# EAGLE design interro-cpu-board-r3 (EAGLE 5.12)
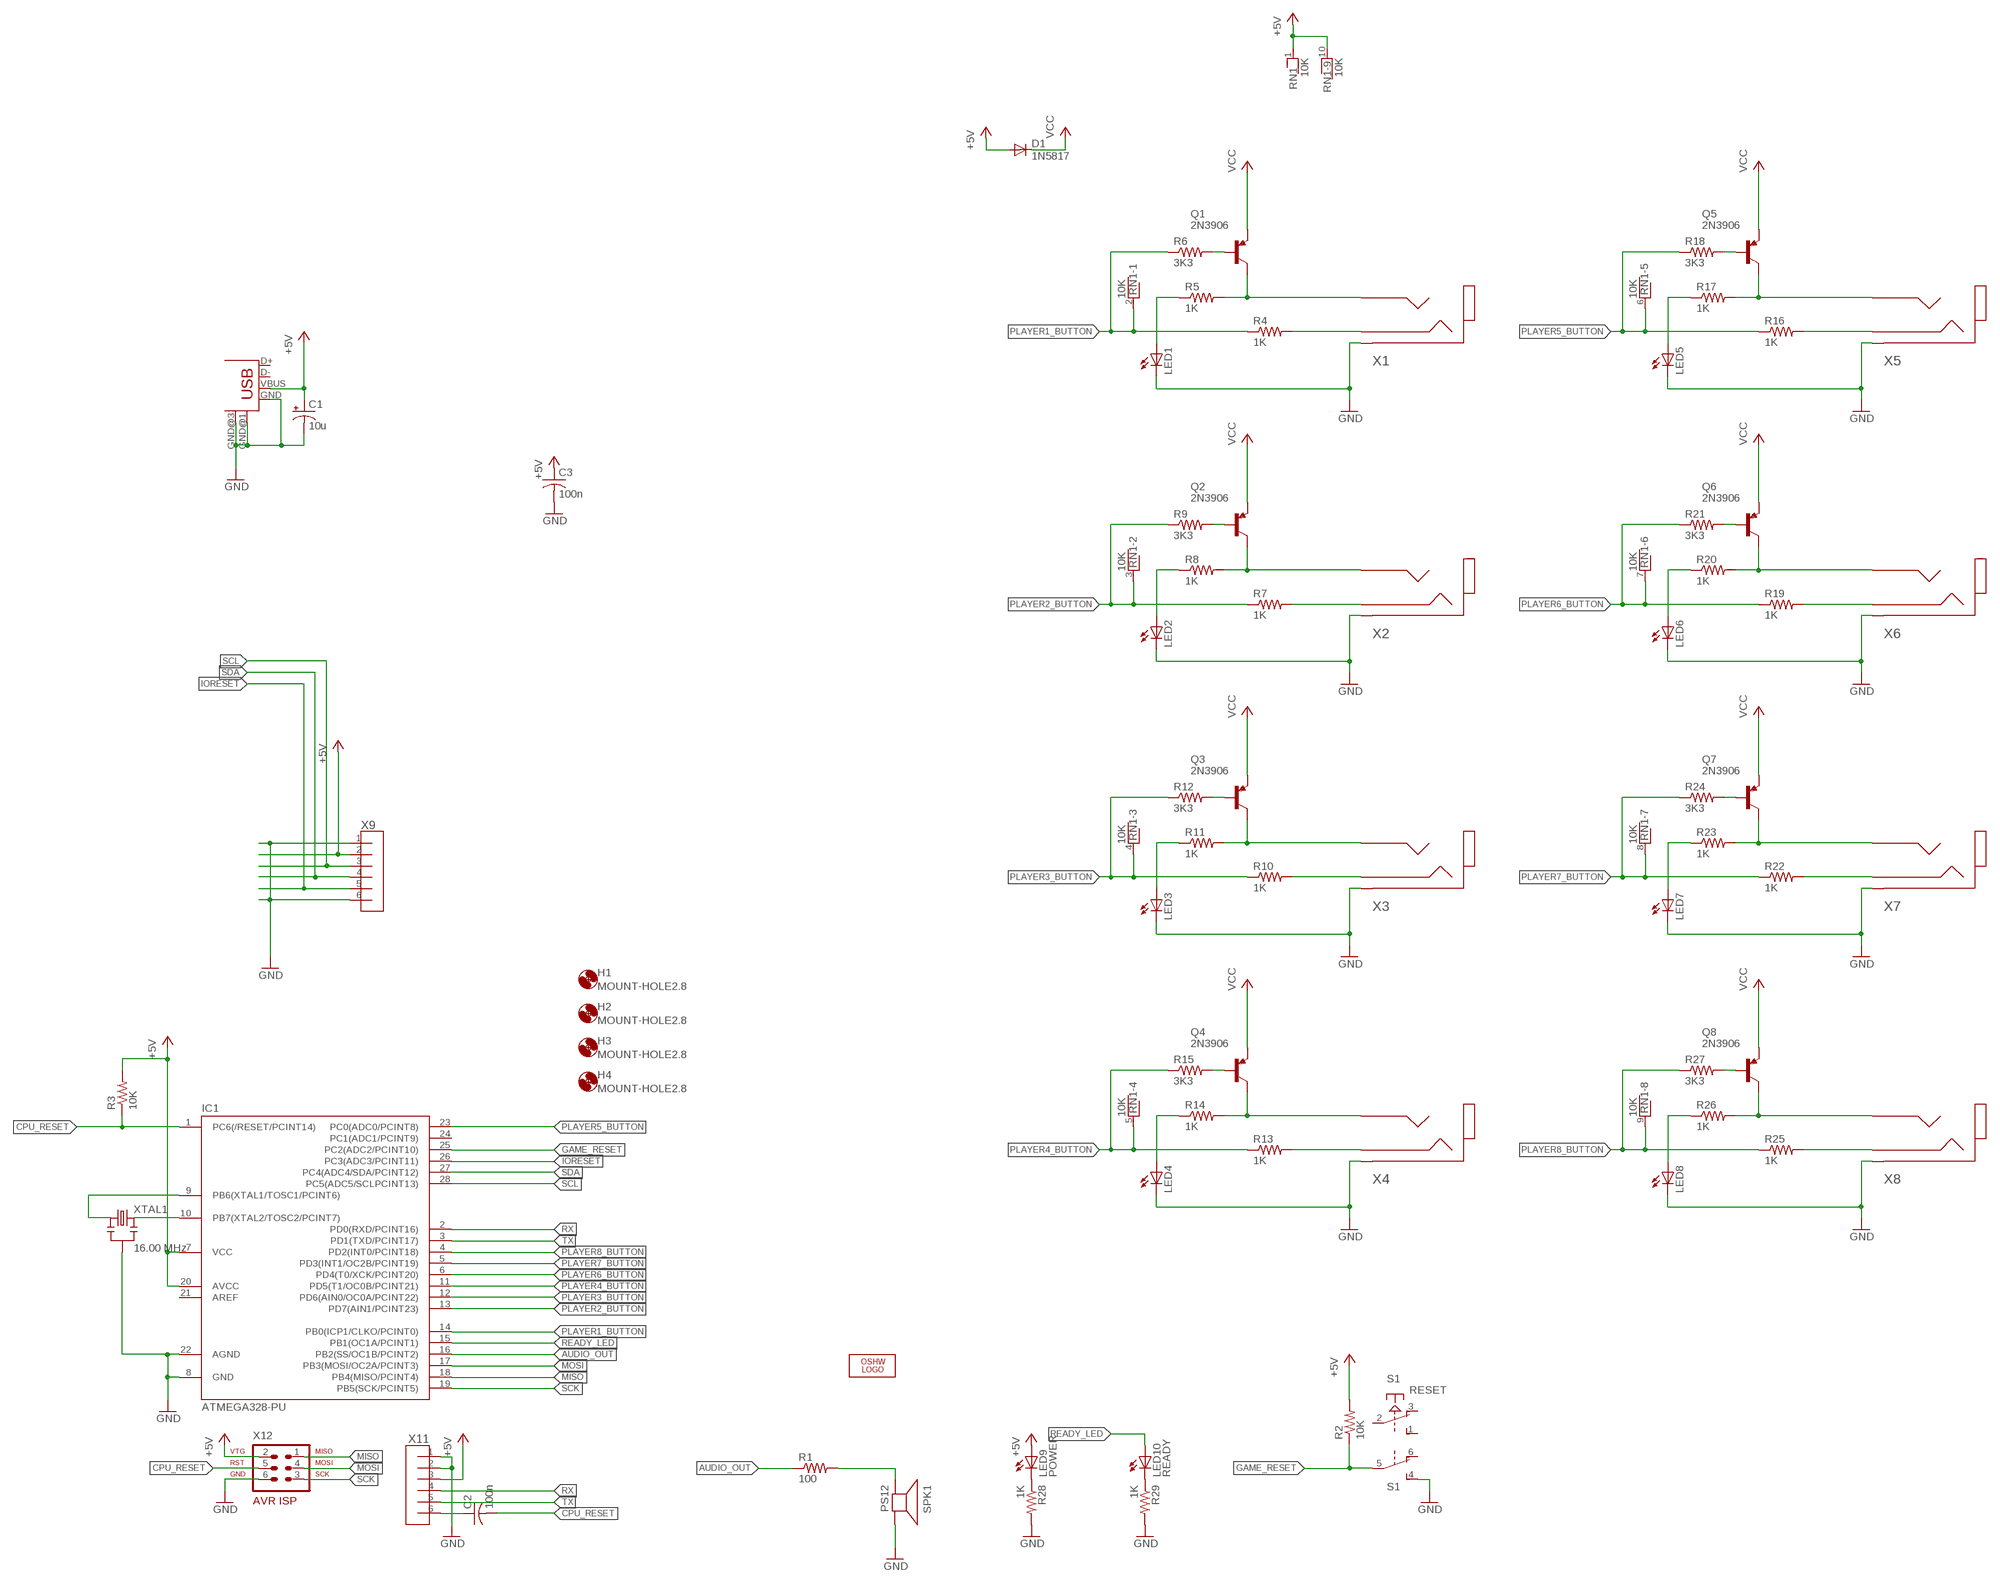
[diagram p0: schematic, sheet 1]

## Parts
C1  10u  CPOL-USE2-5  [E2-5]
C2  100n  C-US025-025X050  [C025-025X050]
C3  100n  C-US025-025X050  [C025-025X050]
D1  1N5817  1N4004  [DO41-10]
H1  MOUNT-HOLE2.8  [2,8]
H2  MOUNT-HOLE2.8  [2,8]
H3  MOUNT-HOLE2.8  [2,8]
H4  MOUNT-HOLE2.8  [2,8]
IC1  ATMEGA328-PU  MEGA48/88/168-PU  [DIL28-3]
LED1  LED3MM  [LED3MM]
LED2  LED3MM  [LED3MM]
LED3  LED3MM  [LED3MM]
LED4  LED3MM  [LED3MM]
LED5  LED3MM  [LED3MM]
LED6  LED3MM  [LED3MM]
LED7  LED3MM  [LED3MM]
LED8  LED3MM  [LED3MM]
LED9  POWER  LED3MM  [LED3MM]
LED10  READY  LED3MM  [LED3MM]
LOGO1  OSHW_LOGO_FILLX0150-NT  [OSHW_FILLX150_NOTEXT]
Q1  2N3906  [TO92]
Q2  2N3906  [TO92]
Q3  2N3906  [TO92]
Q4  2N3906  [TO92]
Q5  2N3906  [TO92]
Q6  2N3906  [TO92]
Q7  2N3906  [TO92]
Q8  2N3906  [TO92]
R1  100  R-US_0207/7  [0207/7]
R2  10K  R-US_0207/7  [0207/7]
R3  10K  R-US_0207/7  [0207/7]
R4  1K  R-US_0207/7  [0207/7]
R5  1K  R-US_0207/7  [0207/7]
R6  3K3  R-US_0207/7  [0207/7]
R7  1K  R-US_0207/7  [0207/7]
R8  1K  R-US_0207/7  [0207/7]
R9  3K3  R-US_0207/7  [0207/7]
R10  1K  R-US_0207/7  [0207/7]
R11  1K  R-US_0207/7  [0207/7]
R12  3K3  R-US_0207/7  [0207/7]
R13  1K  R-US_0207/7  [0207/7]
R14  1K  R-US_0207/7  [0207/7]
R15  3K3  R-US_0207/7  [0207/7]
R16  1K  R-US_0207/7  [0207/7]
R17  1K  R-US_0207/7  [0207/7]
R18  3K3  R-US_0207/7  [0207/7]
R19  1K  R-US_0207/7  [0207/7]
R20  1K  R-US_0207/7  [0207/7]
R21  3K3  R-US_0207/7  [0207/7]
R22  1K  R-US_0207/7  [0207/7]
R23  1K  R-US_0207/7  [0207/7]
R24  3K3  R-US_0207/7  [0207/7]
R25  1K  R-US_0207/7  [0207/7]
R26  1K  R-US_0207/7  [0207/7]
R27  3K3  R-US_0207/7  [0207/7]
R28  1K  R-US_0207/7  [0207/7]
R29  1K  R-US_0207/7  [0207/7]
RN1  10K  RNX9  [RN-10]
S1  RESET  PVA2R  [PVA2R]
SPK1  PS12  SPEAKER/PS12  [PS12]
X1  SJ1-3533N  [SJ1-3533N]
X2  SJ1-3533N  [SJ1-3533N]
X3  SJ1-3533N  [SJ1-3533N]
X4  SJ1-3533N  [SJ1-3533N]
X5  SJ1-3533N  [SJ1-3533N]
X6  SJ1-3533N  [SJ1-3533N]
X7  SJ1-3533N  [SJ1-3533N]
X8  SJ1-3533N  [SJ1-3533N]
X9  M06-100MIL  [100MIL-6]
X10  USB-RAYMOND-SHORT  [USB-MB-RAYMOND-SHORT]
X11  M06-100MIL  [100MIL-6]
X12  AVR-ISP-6  [AVR-ISP-6]
XTAL1  16.00 MHz  RESONATORPTH  [RESONATOR-PTH]

## Nets
+5V: C1.+ C3.1 D1.A IC1.7(VCC) IC1.20(AVCC) LED9.A R2.2 R3.2 RN1.1 RN1.10 X9.2 X10.VBUS X11.3 X12.2
AUDIO_OUT: IC1.16(PB2(SS/OC1B/PCINT2)) R1.1
CPU_RESET: C2.2 IC1.1(PC6(/RESET/PCINT14)) R3.1 X12.5
GAME_RESET: IC1.25(PC2(ADC2/PCINT10)) R2.1 S1.5(2:P)
GND: C1.- C3.2 IC1.8(GND) IC1.22(AGND) LED1.K(C) LED2.K(C) LED3.K(C) LED4.K(C) LED5.K(C) LED6.K(C) LED7.K(C) LED8.K(C) R28.2 R29.2 S1.4(2:S) SPK1.P$2(-) X1.SHIELD(SLEEVE) X2.SHIELD(SLEEVE) X3.SHIELD(SLEEVE) X4.SHIELD(SLEEVE) X5.SHIELD(SLEEVE) X6.SHIELD(SLEEVE) X7.SHIELD(SLEEVE) X8.SHIELD(SLEEVE) X9.1 X9.6 X10.GND X10.GND@1(GND) X10.GND@3(GND) X11.1 X11.2 X12.6 XTAL1.2
IORESET: IC1.26(PC3(ADC3/PCINT11)) X9.5
MISO: IC1.18(PB4(MISO/PCINT4)) X12.1
MOSI: IC1.17(PB3(MOSI/OC2A/PCINT3)) X12.4
N$1: LED9.K(C) R28.1
N$2: R1.2 SPK1.P$1(+)
N$3: LED10.K(C) R29.1
N$4: IC1.10(PB7(XTAL2/TOSC2/PCINT7)) XTAL1.3
N$5: C2.1 X11.6
N$6: IC1.9(PB6(XTAL1/TOSC1/PCINT6)) XTAL1.1
N$9: R4.2 X1.RING
N$10: Q1.1(C) R5.2 X1.TIP
N$12: Q1.2(B) R6.2
N$13: LED1.A R5.1
N$14: R7.2 X2.RING
N$15: Q2.1(C) R8.2 X2.TIP
N$16: Q2.2(B) R9.2
N$17: LED2.A R8.1
N$18: R10.2 X3.RING
N$19: Q3.1(C) R11.2 X3.TIP
N$20: Q3.2(B) R12.2
N$21: LED3.A R11.1
N$22: R13.2 X4.RING
N$23: Q4.1(C) R14.2 X4.TIP
N$24: Q4.2(B) R15.2
N$25: LED4.A R14.1
N$26: R16.2 X5.RING
N$27: Q5.1(C) R17.2 X5.TIP
N$28: Q5.2(B) R18.2
N$29: LED5.A R17.1
N$30: R19.2 X6.RING
N$31: Q6.1(C) R20.2 X6.TIP
N$32: Q6.2(B) R21.2
N$33: LED6.A R20.1
N$34: R22.2 X7.RING
N$35: Q7.1(C) R23.2 X7.TIP
N$36: Q7.2(B) R24.2
N$37: LED7.A R23.1
N$38: R25.2 X8.RING
N$39: Q8.1(C) R26.2 X8.TIP
N$40: Q8.2(B) R27.2
N$41: LED8.A R26.1
PLAYER1_BUTTON: IC1.14(PB0(ICP1/CLKO/PCINT0)) R4.1 R6.1 RN1.2
PLAYER2_BUTTON: IC1.13(PD7(AIN1/PCINT23)) R7.1 R9.1 RN1.3
PLAYER3_BUTTON: IC1.12(PD6(AIN0/OC0A/PCINT22)) R10.1 R12.1 RN1.4
PLAYER4_BUTTON: IC1.11(PD5(T1/OC0B/PCINT21)) R13.1 R15.1 RN1.5
PLAYER5_BUTTON: IC1.23(PC0(ADC0/PCINT8)) R16.1 R18.1 RN1.6
PLAYER6_BUTTON: IC1.6(PD4(T0/XCK/PCINT20)) R19.1 R21.1 RN1.7
PLAYER7_BUTTON: IC1.5(PD3(INT1/OC2B/PCINT19)) R22.1 R24.1 RN1.8
PLAYER8_BUTTON: IC1.4(PD2(INT0/PCINT18)) R25.1 R27.1 RN1.9
READY_LED: IC1.15(PB1(OC1A/PCINT1)) LED10.A
RX: IC1.2(PD0(RXD/PCINT16)) X11.4
SCK: IC1.19(PB5(SCK/PCINT5)) X12.3
SCL: IC1.28(PC5(ADC5/SCLPCINT13)) X9.3
SDA: IC1.27(PC4(ADC4/SDA/PCINT12)) X9.4
TX: IC1.3(PD1(TXD/PCINT17)) X11.5
VCC: D1.C Q1.3(E) Q2.3(E) Q3.3(E) Q4.3(E) Q5.3(E) Q6.3(E) Q7.3(E) Q8.3(E)
Unconnected: IC1.21(AREF) IC1.24(PC1(ADC1/PCINT9)) S1.1(1:S) S1.2(1:P) S1.3(1:O) S1.6(2:O) X10.D+ X10.D-

## Library data of the parts
C1 = rcl:CPOL-US: POLARIZED CAPACITOR, American symbol
C2 C3 = rcl:C-US: CAPACITOR, American symbol
D1 = adafruit:1N4004: DIODE General purpose 1N400x type rectifier (With bigger pads) http://www.ladyada.net/library/pcb/eaglelibrary.html
H1-H4 = holes:MOUNT-HOLE: MOUNTING HOLE with drill center marker
IC1 = avr-5:MEGA48/88/168-PU
LED1-LED10 = led:LED: LED OSRAM: - CHIPLED LG R971, LG N971, LY N971, LG Q971, LY Q971, LO R971, LY R971 LH N974, LH R974 LS Q976, LO Q976, LY Q976 LO Q996 - Hyper CHIPLED LW Q18S LB Q993, LB Q99A, LB R99A - SideLED LS A670, LO A670, LY A670, LG A670, LP A670 LB A673, LV A673, LT A673, LW A673 LH A674 LY A675 LS A676, LA A676, LO A676, LY A676, LW A676 LS A679, LY A679, LG A679 - Hyper Micro SIDELED® LS Y876, LA Y876, LO Y876, LY Y876 LT Y87S - SmartLED LW L88C, LW L88S LB L89C, LB L89S, LG L890 LS L89K, LO L89K, LY L89K LS L896, LA L896, LO L896, LY L896 - TOPLED LS T670, LO T670, LY T670, LG T670, LP T670 LSG T670, LSP T670, LSY T670, LOP T670, LYG T670 LG T671, LOG T671, LSG T671 LB T673, LV T673, LT T673, LW T673 LH T674 LS T676, LA T676, LO T676, LY T676, LB T676, LH T676, LSB T676, LW T676 LB T67C, LV T67C, LT T67C, LS T67K, LO T67K, LY T67K, LW E67C LS E67B, LA E67B, LO E67B, LY E67B, LB E67C, LV E67C, LT E67C LW T67C LS T679, LY T679, LG T679 LS T770, LO T770, LY T770, LG T770, LP T770 LB T773, LV T773, LT T773, LW T773 LH T774 LS E675, LA E675, LY E675, LS T675 LS T776, LA T776, LO T776, LY T776, LB T776 LHGB T686 LT T68C, LB T68C - Hyper Mini TOPLED® LB M676 - Mini TOPLED Santana® LG M470 LS M47K, LO M47K, LY M47K Source: http://www.osram.convergy.de LUXEON: - LUMILED® LXK2-PW12-R00, LXK2-PW12-S00, LXK2-PW14-U00, LXK2-PW14-V00 LXK2-PM12-R00, LXK2-PM12-S00, LXK2-PM14-U00 LXK2-PE12-Q00, LXK2-PE12-R00, LXK2-PE12-S00, LXK2-PE14-T00, LXK2-PE14-U00 LXK2-PB12-K00, LXK2-PB12-L00, LXK2-PB12-M00, LXK2-PB14-N00, LXK2-PB14-P00, LXK2-PB14-Q00 LXK2-PR12-L00, LXK2-PR12-M00, LXK2-PR14-Q00, LXK2-PR14-R00 LXK2-PD12-Q00, LXK2-PD12-R00, LXK2-PD12-S00 LXK2-PH12-R00, LXK2-PH12-S00 LXK2-PL12-P00, LXK2-PL12-Q00, LXK2-PL12-R00 Source: www.luxeon.com KINGBRIGHT: KA-3528ASYC Source: www.kingbright.com
LOGO1 = ohw-logo:OSHW_LOGO_FILL
Q1-Q8 = transistor-pnp:2N3906: PNP Transistor
R1-R29 = rcl:R-US_: RESISTOR, American symbol
RN1 = resistor-net:RNX9: RESISTOR NETWORK; OC_FARNELL: unknown; OC_NEWARK: unknown
S1 = switch-misc:PVA2R: ITT SWITCH
SPK1 = adafruit:SPEAKER: SPEAKER Source: Buerklin Added PS12 (for part # PS1240 piezo) http://www.ladyada.net/library/pcb/eaglelibrary.html
X1-X8 = rbg-cui-audio:SJ1-3533N
X9 X11 = rbg-generic-headers:M06-100MIL
X10 = con-usb-2:USB: USB Connectors
X12 = avr-5:AVR-ISP-6: AVR ISP-6 Serial Programming Header
XTAL1 = SparkFun:RESONATOR: Resonator Small SMD resonator. This is the itty bitty 10/20MHz resonators with built in caps. CSTCE10M0G55 and CSTCE20M0V53. Footprint has been reviewed closely but hasn't been tested yet.

## Board
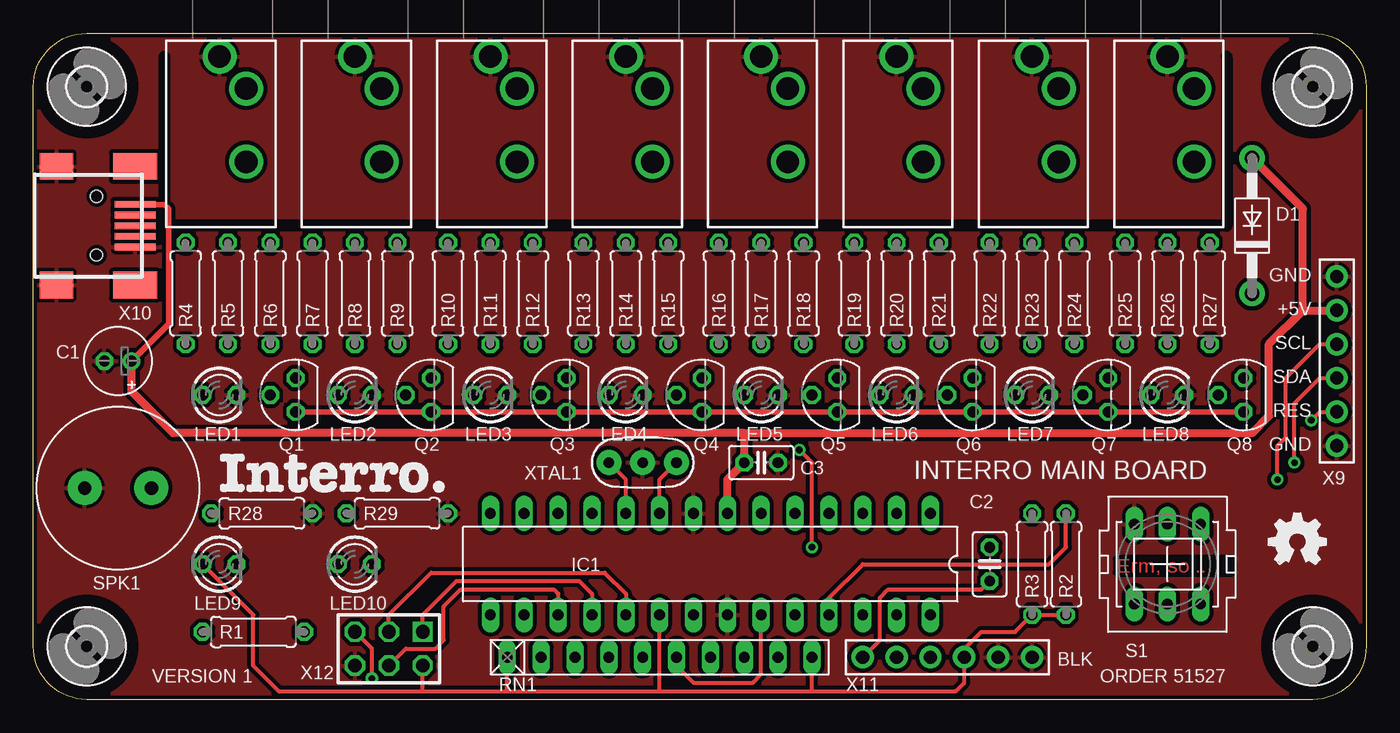
[diagram p1: board, top side]
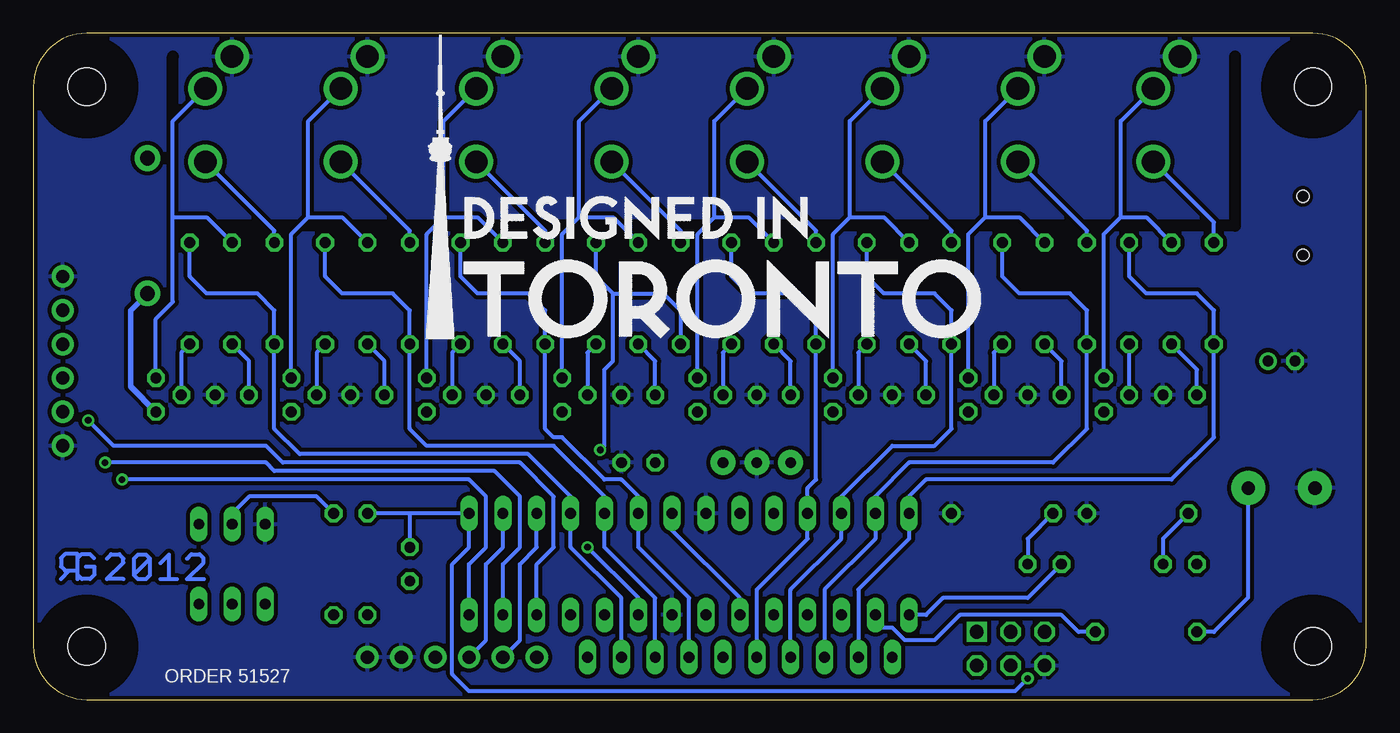
[diagram p2: board, bottom side, seen from below]

Size 100 x 50 mm. Coordinates in mm from the lower left corner, seen from the top.
Outline: 0,46 arc-90 4,50 96,50 arc-90 100,46 100,4 arc-90 96,0 4,0 arc-90 0,4 0,46
Copper layers (1*16): Top 0.035mm / dielectric 1.5mm / Bottom 0.035mm
Design rules "default *": minimum track width 8mil, minimum drill 19mil, track to track 10mil, track to pad 10mil, pad to pad 10mil, via to via 10mil, smd to smd 10mil, copper to edge 10mil, drill to drill 8mil, minimum pad ring 10mil, minimum via ring 8mil, stop-mask expansion 4mil, vias tented up to drill 20mil, thermal gap 10mil
tRestrict: 3 lines
bRestrict: 3 lines

### Footprints (pad centres in the part's own frame; a part is rotated, then mirrored left to right if it is on the bottom)
E2-5 = drill 0.813 pad 1.27 round: + -1.016,0 | drill 0.813 pad 1.27 octagon: - 1.016,0
C025-025X050 = drill 0.813 octagon: 1 -1.27,0; 2 1.27,0
DO41-10 = drill 1.118 pad 1.93 round: A 5.08,0; C -5.08,0
2,8 = hole 2.8: 0,0
DIL28-3 = drill 0.813 long: 1 -16.51,-3.81; 2 -13.97,-3.81; 3 -11.43,-3.81; 4 -8.89,-3.81; 5 -6.35,-3.81; 6 -3.81,-3.81; 7 -1.27,-3.81; 8 1.27,-3.81; 9 3.81,-3.81; 10 6.35,-3.81; 11 8.89,-3.81; 12 11.43,-3.81; 13 13.97,-3.81; 14 16.51,-3.81; 15 16.51,3.81; 16 13.97,3.81; 17 11.43,3.81; 18 8.89,3.81; 19 6.35,3.81; 20 3.81,3.81; 21 1.27,3.81; 22 -1.27,3.81; 23 -3.81,3.81; 24 -6.35,3.81; 25 -8.89,3.81; 26 -11.43,3.81; 27 -13.97,3.81; 28 -16.51,3.81
LED3MM = drill 0.813 octagon: A -1.27,0; K 1.27,0
TO92 = drill 0.813 octagon: 1 1.27,0; 2 0,1.905; 3 -1.27,0
0207/7 = drill 0.813 octagon: 1 -3.81,0; 2 3.81,0
RN-10 = drill 0.813 long: 1 -11.43,0; 2 -8.89,0; 3 -6.35,0; 4 -3.81,0; 5 -1.27,0; 6 1.27,0; 7 3.81,0; 8 6.35,0; 9 8.89,0; 10 11.43,0
PVA2R = drill 0.813 long: 1 -2.997,2.489; 2 -2.997,0; 3 -2.997,-2.489; 4 2.997,2.489; 5 2.997,0; 6 2.997,-2.489
PS12 = drill 1 pad 2.54 round: P$1 -2.5,0; P$2 2.5,0
SJ1-3533N = drill 1.7 round: RING 7.9,2; SHIELD 0,0; TIP 2.4,2
100MIL-6 = drill 1 pad 1.676 round: 1 -6.35,0; 2 -3.81,0; 3 -1.27,0; 4 1.27,0; 5 3.81,0; 6 6.35,0
USB-MB-RAYMOND-SHORT = smd 0.5 x 3.1: D+ 0,4.15; D- -0.8,4.15; GND 1.6,4.15; ID 0.8,4.15; VBUS -1.6,4.15 | smd 2 x 2.5: GND@1 -4.45,-1.75; GND@3 4.45,-1.75 | smd 2 x 3.3: GND@2 -4.45,4.15; GND@4 4.45,4.15 | hole 0.9: -2.2,1.25; 2.2,1.25
AVR-ISP-6 = drill 1.016 square: 1 -2.54,-1.27 | drill 1.016 octagon: 2 -2.54,1.27; 3 0,-1.27; 4 0,1.27; 5 2.54,-1.27; 6 2.54,1.27
RESONATOR-PTH = drill 0.8 pad 1.88 round: 1 -2.54,0; 2 0,0; 3 2.54,0

### Placement (x,y rotation side)
C1  6.35,25.4 180 top
C2  71.75,10.16 90 top
C3  54.61,17.78 0 top
D1  91.44,35.56 90 top
H1  4,4 0 top
H2  4,46 0 top
H3  96,46 0 top
H4  96,4 0 top
IC1  50.8,10.16 180 top
LED1  13.97,22.86 0 top
LED2  24.13,22.86 0 top
LED3  34.29,22.86 0 top
LED4  44.45,22.86 0 top
LED5  54.61,22.86 0 top
LED6  64.77,22.86 0 top
LED7  74.93,22.86 0 top
LED8  85.09,22.86 0 top
LED9  13.97,10.16 0 top
LED10  24.13,10.16 0 top
LOGO1  92.71,10.16 0 top
Q1  19.68,22.86 90 top
Q2  29.84,22.86 90 top
Q3  40.01,22.86 90 top
Q4  50.16,22.86 90 top
Q5  60.33,22.86 90 top
Q6  70.48,22.86 90 top
Q7  80.64,22.86 90 top
Q8  90.81,22.86 90 top
R1  16.51,5.08 180 top
R2  77.47,10.16 270 top
R3  74.93,10.16 270 top
R4  11.43,30.48 90 top
R5  14.61,30.48 90 top
R6  17.78,30.48 270 top
R7  20.95,30.48 90 top
R8  24.13,30.48 90 top
R9  27.3,30.48 270 top
R10  31.11,30.48 90 top
R11  34.29,30.48 90 top
R12  37.47,30.48 270 top
R13  41.27,30.48 90 top
R14  44.45,30.48 90 top
R15  47.62,30.48 270 top
R16  51.44,30.48 90 top
R17  54.61,30.48 90 top
R18  57.78,30.48 270 top
R19  61.59,30.48 90 top
R20  64.77,30.48 90 top
R21  67.94,30.48 270 top
R22  71.75,30.48 90 top
R23  74.93,30.48 90 top
R24  78.11,30.48 270 top
R25  81.92,30.48 90 top
R26  85.09,30.48 90 top
R27  88.27,30.48 270 top
R28  17.14,13.97 0 top
R29  27.3,13.97 0 top
RN1  46.99,3.17 0 top
S1  85.09,10.16 90 top
SPK1  6.35,15.88 180 top
U$1  [RGLOGO_SMALL_2012]  96.52,8.89 0 bottom
U$2  [INTERRO-LOGO]  10.16,14.29 0 top
U$3  [DESIGNED_IN_TORONTO]  71.12,26.67 0 bottom
X1  13.97,48.26 270 top
X2  24.13,48.26 270 top
X3  34.29,48.26 270 top
X4  44.45,48.26 270 top
X5  54.61,48.26 270 top
X6  64.77,48.26 270 top
X7  74.93,48.26 270 top
X8  85.09,48.26 270 top
X9  97.79,25.4 270 top
X10  3.49,35.56 270 top
X11  68.58,3.17 180 top
X12  26.67,3.81 180 top
XTAL1  45.72,17.78 180 top

### Tracks (layer width: path | path; a pad name or v marks a point on that pad's centre or on a via)
+5V
  Top 0.305: 58.42,0.64 RN1.10 | 58.42,0.64 69.22,0.64 69.85,1.27 X11.3 69.85,3.81 71.12,5.08 73.66,5.08 R3.2 R2.2 | 35.56,0.64 RN1.1 | 35.56,0.64 46.99,0.64 | 46.99,0.64 IC1.20 | 46.99,0.64 58.42,0.64 | LED9.A 16.51,6.35 16.51,2.54 18.41,0.64 29.21,0.64 | 29.21,0.64 35.56,0.64 | 29.21,0.64 X12.2
  Top 0.406: X10.VBUS 9.83,37.16 10.16,36.83 10.16,28.19 C1.+
  Top 0.61: 53.34,20 10.48,20 7.37,23.11 C1.+ | 95.25,29.21 92.71,26.67 92.71,21.27 91.44,20 53.34,20 | 95.25,29.21 X9.2 | 53.34,20 C3.1 52.07,16.51 IC1.7 | 95.25,29.21 95.25,36.83 D1.A
  Bottom 0.305: IC1.20 46.99,7.62 52.07,12.7 IC1.7
AUDIO_OUT
  Bottom 0.305: R1.1 21.59,5.08 22.86,6.35 30.48,6.35 32.38,4.45 34.61,4.45 35.56,5.4 36.51,5.4 36.83,5.71 IC1.16
CPU_RESET  (via drill 0.5)
  Top 0.305: X12.5 25.4,3.81 v25.4,1.59
  Bottom 0.305: 71.75,13.97 IC1.1 67.31,11.43 68.58,10.16 68.58,1.91 67.31,0.64 26.35,0.64 v25.4,1.59 | 71.75,13.97 R3.1 | 71.75,13.97 C2.2
GAME_RESET
  Top 0.305: IC1.25 59.69,7.62 62.23,10.16 76.2,10.16 77.47,11.43 R2.1
  Bottom 0.305: S1.5 85.09,13.97 83.82,15.24 78.74,15.24 R2.1
GND
  pour Bottom (isolate 0.305): -1.27,50.8 100.33,50.8 100.33,0 100.33,-1.27 -1.27,-1.27
  pour Top (isolate 0.305): -1.27,50.8 100.33,50.8 100.33,0 100.33,-1.27 -1.27,-1.27
IORESET  (via drill 0.5)
  Top 0.305: v95.89,20.95 96.52,21.59 X9.5
  Bottom 0.305: IC1.26 62.23,10.16 60.96,11.43 60.96,15.24 63.5,17.78 81.28,17.78 82.55,19.05 93.98,19.05 v95.89,20.95
MISO
  Top 0.305: IC1.18 41.91,7.94 40.96,8.89 31.75,8.89 29.21,6.35 X12.1
MOSI
  Top 0.305: IC1.17 39.37,7.94 39.05,8.26 32.07,8.26 30.8,6.99 30.8,4.45 30.16,3.81 27.94,3.81 X12.4
N$1
  Bottom 0.305: R28.1 15.24,12.06 LED9.K
N$2
  Bottom 0.305: R1.2 11.43,5.08 8.85,7.66 SPK1.P$1
N$3
  Bottom 0.305: R29.1 25.4,12.06 LED10.K
N$4
  Top 0.305: IC1.10 44.45,16.51 XTAL1.3
N$5
  Top 0.305: X11.6 63.5,4.45 63.5,7.62 64.14,8.26 71.12,8.26 C2.1
N$6
  Top 0.305: IC1.9 46.99,16.51 XTAL1.1
N$9
  Bottom 0.305: R4.2 11.43,35.82 X1.RING
N$10
  Bottom 0.305: Q1.1 19.68,34.92 18.41,36.2 | 18.41,36.2 18.41,43.41 X1.TIP | 18.41,36.2 16.51,36.2 R5.2
N$12
  Bottom 0.305: Q1.2 R6.2
N$13
  Bottom 0.305: LED1.A 12.7,24.77 R5.1
N$14
  Bottom 0.305: R7.2 20.95,35.19 X2.RING
N$15
  Bottom 0.305: Q2.1 29.84,34.92 28.57,36.2 | 28.57,36.2 28.57,43.41 X2.TIP | 28.57,36.2 26.04,36.2 R8.2
N$16
  Bottom 0.305: Q2.2 27.94,26.04 R9.2
N$17
  Bottom 0.305: LED2.A 22.86,25.4 R8.1
N$18
  Bottom 0.305: R10.2 31.11,35.19 X3.RING
N$19
  Bottom 0.305: Q3.1 40.01,34.92 38.73,36.2 | 38.73,36.2 38.73,43.41 X3.TIP | R11.2 36.2,36.2 38.73,36.2
N$20
  Bottom 0.305: Q3.2 38.1,26.04 R12.2
N$21
  Bottom 0.305: LED3.A 33.02,25.4 R11.1
N$22
  Bottom 0.305: R13.2 41.27,35.19 X4.RING
N$23
  Bottom 0.305: Q4.1 50.16,34.92 48.9,36.2 | 48.9,36.2 46.35,36.2 R14.2 | 48.9,36.2 48.9,43.41 X4.TIP
N$24
  Bottom 0.305: Q4.2 48.26,26.04 R15.2
N$25
  Bottom 0.305: LED4.A 43.18,25.4 R14.1
N$26
  Bottom 0.305: R16.2 51.44,35.19 X5.RING
N$27
  Bottom 0.305: Q5.1 60.33,34.92 59.05,36.2 | R17.2 56.52,36.2 59.05,36.2 | 59.05,36.2 59.05,43.41 X5.TIP
N$28
  Bottom 0.305: Q5.2 58.42,26.04 R18.2
N$29
  Bottom 0.305: LED5.A 53.34,25.4 R17.1
N$30
  Bottom 0.305: R19.2 61.59,35.19 X6.RING
N$31
  Bottom 0.305: Q6.1 70.48,34.92 69.22,36.2 | R20.2 66.67,36.2 69.22,36.2 | 69.22,36.2 69.22,43.41 X6.TIP
N$32
  Bottom 0.305: Q6.2 68.58,26.04 R21.2
N$33
  Bottom 0.305: LED6.A 63.5,25.4 R20.1
N$34
  Bottom 0.305: R22.2 71.75,35.19 X7.RING
N$35
  Bottom 0.305: X7.TIP 79.38,43.41 79.38,36.2 | Q7.1 80.64,34.92 79.38,36.2 | 79.38,36.2 76.83,36.2 R23.2
N$36
  Bottom 0.305: Q7.2 78.74,26.04 R24.2
N$37
  Bottom 0.305: LED7.A 73.66,25.4 R23.1
N$38
  Bottom 0.305: R25.2 81.92,35.19 X8.RING
N$39
  Bottom 0.305: X8.TIP 89.53,43.41 89.53,36.2 | Q8.1 90.81,28.57 89.53,29.84 89.53,36.2 | 89.53,36.2 87,36.2 R26.2
N$40
  Bottom 0.305: Q8.2 88.9,26.04 R27.2
N$41
  Bottom 0.305: R26.1 83.82,25.4 LED8.A
PLAYER1_BUTTON
  Bottom 0.305: RN1.2 38.1,8.26 34.29,12.06 IC1.14 34.29,15.24 33.02,16.51 14.61,16.51 11.43,19.68 R4.1 11.43,29.21 12.7,30.48 16.51,30.48 17.78,31.75 R6.1
PLAYER2_BUTTON
  Bottom 0.305: RN1.3 40.64,8.26 36.83,12.06 IC1.13 36.83,15.24 34.29,17.78 23.5,17.78 20.95,20.32 R7.1 20.95,29.21 22.23,30.48 26.04,30.48 27.3,31.75 R9.1
PLAYER3_BUTTON
  Bottom 0.305: RN1.4 43.18,8.26 39.37,12.06 IC1.12 39.37,15.24 35.56,19.05 32.38,19.05 31.11,20.32 R10.1 31.11,29.21 32.38,30.48 36.2,30.48 37.47,31.75 R12.1
PLAYER4_BUTTON
  Bottom 0.305: RN1.5 45.72,8.26 41.91,12.06 IC1.11 41.91,15.88 41.27,16.51 R13.1 41.27,29.21 42.55,30.48 46.35,30.48 47.62,31.75 R15.1
PLAYER5_BUTTON  (via drill 0.5)
  Top 0.305: RN1.6 48.26,2.54 49.53,1.27 53.98,1.27 54.61,1.91 IC1.23 | v58.42,11.43 58.42,17.78 v57.47,18.73
  Bottom 0.305: R18.1 57.78,31.75 56.52,30.48 | 56.52,30.48 52.7,30.48 51.44,29.21 R16.1 | IC1.23 54.61,7.62 v58.42,11.43 | v57.47,18.73 57.15,19.05 57.15,24.77 56.52,25.4 56.52,30.48
PLAYER6_BUTTON
  Bottom 0.305: RN1.7 50.8,7.62 54.61,11.43 IC1.6 54.61,15.24 55.88,16.51 57.15,16.51 60.33,19.68 60.96,19.68 61.59,20.32 R19.1 61.59,29.21 62.87,30.48 66.67,30.48 67.94,31.75 R21.1
PLAYER7_BUTTON
  Bottom 0.305: RN1.8 53.34,7.62 57.15,11.43 IC1.5 57.15,15.24 60.96,19.05 70.48,19.05 71.75,20.32 R22.1 71.75,29.21 73.03,30.48 76.83,30.48 78.11,31.75 R24.1
PLAYER8_BUTTON
  Bottom 0.305: RN1.9 55.88,7.62 59.69,11.43 IC1.4 59.69,15.24 62.87,18.41 80.01,18.41 81.92,20.32 R25.1 81.92,29.21 83.19,30.48 87,30.48 88.27,31.75 R27.1
READY_LED
  Bottom 0.305: IC1.15 33.02,6.35 31.75,7.62 25.4,7.62 LED10.A
RX
  Bottom 0.305: IC1.2 64.77,11.43 66.04,10.16 66.04,4.45 X11.4
SCK
  Top 0.305: IC1.19 44.45,7.94 42.86,9.53 29.84,9.53 26.67,6.35 X12.3
SCL  (via drill 0.5)
  Top 0.305: v93.34,16.51 93.34,19.05 93.98,19.68 93.98,24.13 96.52,26.67 X9.3
  Bottom 0.305: IC1.28 67.31,10.16 66.04,11.43 66.04,15.24 67.31,16.51 v93.34,16.51
SDA  (via drill 0.5)
  Top 0.305: v94.61,17.78 94.61,22.23 96.52,24.13 X9.4
  Bottom 0.305: IC1.27 64.77,10.16 63.5,11.43 63.5,15.24 65.41,17.14 81.92,17.14 82.55,17.78 v94.61,17.78
TX
  Bottom 0.305: IC1.3 62.23,11.43 63.5,10.16 63.5,4.45 X11.5
VCC
  Top 0.406: Q8.3 Q7.3 Q6.3 Q5.3 Q4.3 Q3.3 Q2.3 Q1.3
  Bottom 0.406: D1.C 92.71,29.21 92.71,23.5 Q8.3

### Text on the board
Top: Erm, so...
tNames: GND | +5V | SCL | SDA | RES | GND | XTAL1 | INTERRO MAIN BOARD | BLK | VERSION 1 | ORDER 51527
bNames: ORDER 51527